# Altium schematic sheet X99_20241008.SchDoc
size A4
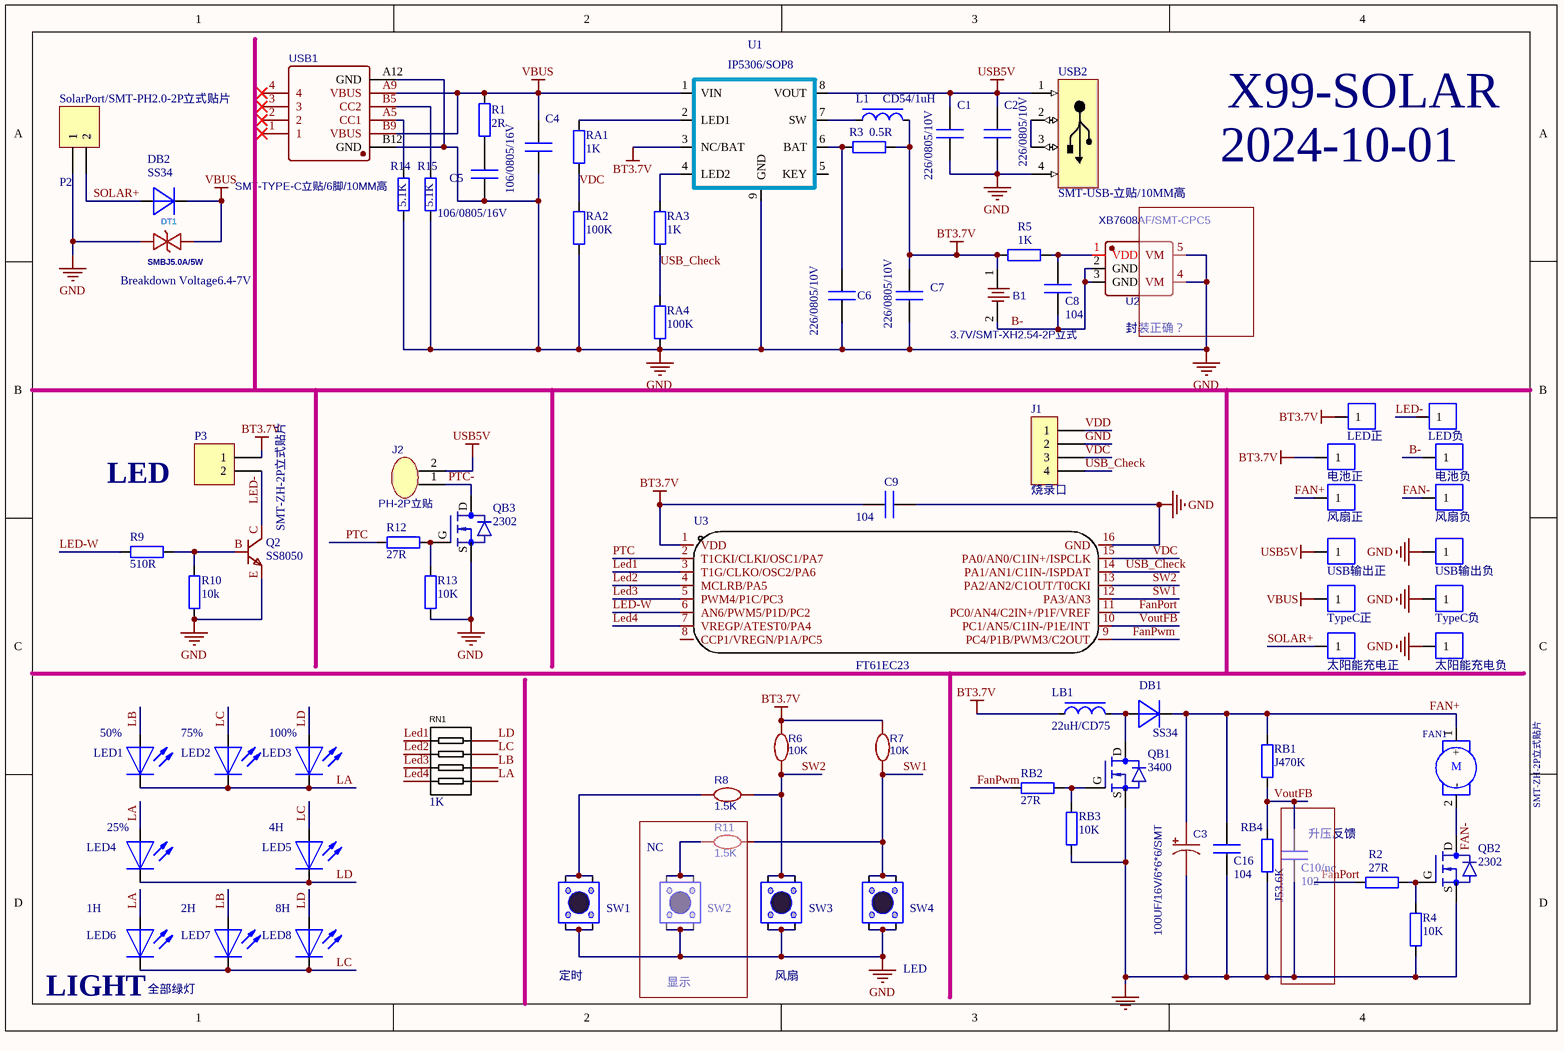
[diagram p0: X99_20241008.SchDoc]

## Parts
B1  3.7V/SMT-XH2.54-2P立式  [SMT-XH2.54-2P立式]
C1  226/0805/10V  [SMT-0805C]
C2  226/0805/10V  [SMT-0805C]
C3  100UF/16V/6*6*6/SMT  [CS 6*6 - V]
C4  106/0805/16V  [SMT-0805C]
C5  106/0805/16V  [SMT-0805C]
C6  226/0805/10V  [SMT-0805C]
C7  226/0805/10V  [SMT-0805C]
C8  104  [SMT-0603C]
C9  104  [SMT-0603C]
C10/nc  102  [SMT-0603C]
C16  104  [SMT-0603C]
DB1  SS34  [SMT-SMA(DO-214AC)]
DB2  SS34  [SMT-SMA(DO-214AC)]
DT1  SMBJ5.0A/5W  [SMT-SMB(DO-214AA)]
FAN1  SMT-ZH-2P立式贴片  [SMT-ZH-2AB]
J1  烧录口  [SMT-烧录口]
J2  PH-2P立贴  [SMT-PH2.0-2P立式贴片]
L1  CD54/1uH  [CD54]
LB1  22uH/CD75  [SMT-CD75_L]
LED1  (no value)  [SMT-0603LED（绿灯）]
LED2  (no value)  [SMT-0603LED（绿灯）]
LED3  (no value)  [SMT-0603LED（绿灯）]
LED4  (no value)  [SMT-0603LED（绿灯）]
LED5  (no value)  [SMT-0603LED（绿灯）]
LED6  (no value)  [SMT-0603LED（绿灯）]
LED7  (no value)  [SMT-0603LED（绿灯）]
LED8  (no value)  [SMT-0603LED（绿灯）]
LED正  测试点  [test3.0_top]  (value not drawn)
LED负  测试点  [test3.0_top]  (value not drawn)
P2  SolarPort/SMT-PH2.0-2P立式贴片  [SMT-PH2.0-2P立式贴片]
P3  SMT-ZH-2P立式贴片  [SMT-ZH-2AB]
Q2  SS8050  [SMT-SOT-23(BJT)]
QB1  3400  [SMT-SOT-23 (NMOS)]
QB2  2302  [SMT-SOT-23 (NMOS)]
QB3  2302  [SMT-SOT-23 (NMOS)]
R1  2R  [SMT-0603R]
R2  27R  [SMT-0603R]
R3  0.5R  [SMT-0603R]
R4  10K  [SMT-0603R]
R5  1K  [SMT-0603R]
R6  10K  [SMT-0603R]
R7  10K  [SMT-0603R]
R8  1.5K  [SMT-0603R]
R9  510R  [SMT-0603R]
R10  10k  [SMT-0603R]
R11  1.5K  [SMT-0603R]
R12  27R  [SMT-0603R]
R13  10K  [SMT-0603R]
R14  5.1K  [0603_R]
R15  5.1K  [0603_R]
RA1  1K  [SMT-0603R]
RA2  100K  [SMT-0603R]
RA3  1K  [SMT-0603R]
RA4  100K  [SMT-0603R]
RB1  J470K  [SMT-0603R]
RB2  27R  [SMT-0603R]
RB3  10K  [SMT-0603R]
RB4  J53.6K  [SMT-0603R]
RN1  1K  [SMT0603*4]
SW1  SMT-6X6*7.5  [SMT-6X6轻触开关通用]  (value not drawn)
SW2  SMT-6X6*7.5  [SMT-6X6轻触开关通用]  (value not drawn)
SW3  SMT-6X6*7.5  [SMT-6X6轻触开关通用]  (value not drawn)
SW4  SMT-6X6*7.5  [SMT-6X6轻触开关通用]  (value not drawn)
TypeC正  测试点  [test3.0_top]  (value not drawn)
TypeC负  测试点  [test3.0_top]  (value not drawn)
U1  IP5306/SOP8  [SMT-ESOP-8 锡膏]
U2  XB7608AF/SMT-CPC5  [SMT-CPC5]
U3  FT61EC23  [SMT-SOP-16]
USB1  SMT-TYPE-C立贴/6脚/10MM高  [SMT-TypeC-6P立式贴片(新)]
USB2  SMT-USB-立贴/10MM高  [SMT-USB-立贴]
USB输出正  测试点  [test3.0_top]  (value not drawn)
USB输出负  测试点  [test3.0_top]  (value not drawn)
太阳能充电正  测试点  [test3.0_top]  (value not drawn)
太阳能充电负  测试点  [test3.0_top]  (value not drawn)
电池正  测试点  [test3.0_top]  (value not drawn)
电池负  测试点  [test3.0_top]  (value not drawn)
风扇正  测试点  [test3.0_top]  (value not drawn)
风扇负  测试点  [test3.0_top]  (value not drawn)

## Blocks framed on the sheet
升压反馈: C10/nc

## Nets
BT3.7V: B1.1 C7.2 C9.2 L1.2 LB1.1 LED正.1 P3.1 R3.1 R5.2 R6.1 R7.1 U1.3(NC/BAT) U3.1(VDD) 电池正.1
GND: C1.1 C2.1 C3.2 C4.1 C5.1 C6.2 C7.1 C9.1 C10/nc.1 C16.1 DT1.1 J1.2 P2.1 Q2.E QB1.S QB2.S QB3.S R4.1 R10.1 R13.1 R14.2 R15.2 RA2.1 RA4.1 RB3.1 RB4.1 SW1.1 SW1.3 SW2.1 SW2.3 SW3.1 SW3.3 SW4.1 SW4.3 TypeC负.1 U1.9(GND) U2.4(VM) U2.5(VM) U3.16(GND) USB1.A12(GND) USB1.B12(GND) USB2.4 USB输出负.1 太阳能充电负.1
USB5V: C1.2 C2.2 J2.2 U1.8(VOUT) USB2.1 USB输出正.1
VBUS: C4.2 DB2.2 DT1.2 R1.2 TypeC正.1 U1.1(VIN) USB1.A9(VBUS) USB1.B9(VBUS)
B-: B1.2 C8.1 U2.2(GND) U2.3(GND) 电池负.1
FAN+: C3.1 C16.2 DB1.2 FAN1.1(+) RB1.2 风扇正.1
FAN-: FAN1.2(-) QB2.D 风扇负.1
FanPort: R2.2 U3.11(PC0/AN4/C2IN+/P1F/VREF)
FanPwm: RB2.1 U3.9(PC4/P1B/PWM3/C2OUT)
LA: LED1.2 LED2.2 LED3.2 LED4.1 LED6.1 RN1.5
LB: LED1.1 LED7.1 RN1.6
LC: LED2.1 LED5.1 LED6.2 LED7.2 LED8.2 RN1.7
LD: LED3.1 LED4.2 LED5.2 LED8.1 RN1.8
Led1: RN1.1 U3.3(T1G/CLKO/OSC2/PA6)
Led2: RN1.2 U3.4(MCLRB/PA5)
Led3: RN1.3 U3.5(PWM4/P1C/PC3)
Led4: RN1.4 U3.7(VREGP/ATEST0/PA4)
LED-: LED负.1 P3.2 Q2.C
LED-W: R9.1 U3.6(AN6/PWM5/P1D/PC2)
PTC: R12.2 U3.2(T1CKI/CLKI/OSC1/PA7)
PTC-: J2.1 QB3.D
SOLAR+: DB2.1 P2.2 太阳能充电正.1
SW1: R7.2 R11.2 SW4.2 SW4.4 U3.12(PA3/AN3)
SW2: R6.2 R8.2 SW3.2 SW3.4 U3.13(PA2/AN2/C1OUT/T0CKI)
USB_Check: J1.4 RA3.1 RA4.2 U3.14(PA1/AN1/C1IN-/ISPDAT)
VDC: J1.3 RA1.1 RA2.2 U3.15(PA0/AN0/C1IN+/ISPCLK)
VDD: J1.1
VoutFB: C10/nc.2 RB1.1 RB4.2 U3.10(PC1/AN5/C1IN-/P1E/INT)
NetC5_2: C5.2 R1.1
NetC6_1: C6.1 R3.2 U1.6(BAT)
NetC8_2: C8.2 R5.1 U2.1(VDD)
NetDB1_1: DB1.1 LB1.2 QB1.D
NetL1_1: L1.1 U1.7(SW)
NetQ2_B: Q2.B R9.2 R10.2
NetQB1_G: QB1.G RB2.2 RB3.2
NetQB2_G: QB2.G R2.1 R4.2
NetQB3_G: QB3.G R12.1 R13.2
NetR8_1: R8.1 SW1.2 SW1.4
NetR11_1: R11.1 SW2.2 SW2.4
NetR14_1: R14.1 USB1.A5(CC1)
NetR15_1: R15.1 USB1.B5(CC2)
NetRA1_2: RA1.2 U1.2(LED1)
NetRA3_2: RA3.2 U1.4(LED2)
NetUSB2_2: USB2.2 USB2.3

Not connected (* = marked no-connect by the designer): U1 5(KEY); U3 8(CCP1/VREGN/P1A/PC5); USB1 1* 2* 3* 4*

## Notes on the sheet
- X99-SOLAR
- 2024-10-01
- (near DT1) Breakdown Voltage6.4-7V
- (near U2) 封装正确？
- LED
- (near LED1) 50%
- 75%
- (near LED3) 100%
- (near LED4) 25%
- (near LED5) 4H
- (near SW2) NC
- 1H
- 2H
- 8H
- (near SW1) 定时
- 显示
- (near SW3) 风扇
- (near SW4) LED
- (near LED6) LIGHT
- (near LED6) 全部绿灯
- (in symbol MotorDC-P) M

## Library data of the parts
B1 = 12V: BOM_Manufacturer: Q&J; BOM_Manufacturer Part: CR1220-2; BOM_Supplier: LCSC; image: //image.lceda.cn/szlcsc/C70381.jpg; BOM_Supplier Part: C70381; spicePre: B; spiceSymbolName: CR1220-2
C1 C2 C4-C9 C10/nc C16 = Cap
C3 = 220uF/35V: BOM_Manufacturer: BERYL Electronic Tech; BOM_Manufacturer Part: RC050M4R7LO5*11TH-2A1E; nameAlias: Capacitance; Contributor: s-dawn; BOM_Supplier: LCSC; BOM_Supplier Part: C365767; BOM_JLCPCB Part Class: Extended Part; spicePre: C; spiceSymbolName: C1
DB1 DB2 = Diode
DT1 = SMBJ5.0CA_C19077559: Manufacturer: 宏迦橙; Add into BOM: yes; polarity: 双向; Reverse Stand-Off Voltage (Vrwm): 5V; Maximum Clamping Voltage: 9.2V; Peak Pulse Current (Ipp)@10/1000us: 65.22A; Peak Pulse Power Dissipation (Ppp)@10/1000us: 600W; Breakdown Voltage: 7V; Reverse Leakage Current (Ir): 800uA; Symbol: SMBJ5.0CA_C19077559; Device: SMBJ5.0CA_C19077559; LCSC Part Name: SMBJ5.0CA; Supplier Part: C19077559; Manufacturer Part: SMBJ5.0CA; Supplier Footprint: SMB; JLCPCB Part Class: Extended Part; Datasheet: https://atta.szlcsc.com/upload/public/pdf/source/20231129/482485C5E60BCB53F84D553F3B29D8A3.pdf; Supplier: LCSC; Convert to PCB: yes; Operating Temperature: -55℃~+155℃; Type: TVS
FAN1 = MotorDC-P
J1 = Pin HDR1X4
J2 = 2P: Contributor: guilingSong; spicePre: J; spiceSymbolName: 2P
L1 LB1 = L Core
LED1-LED8 = LED
LED正 LED负 TypeC正 TypeC负 USB输出正 USB输出负 太阳能充电正 太阳能充电负 电池正 电池负 风扇正 风扇负 = 1P
P2 P3 = Header 2: Header, 2-Pin; LatestRevisionDate: 17-Jul-2002; LatestRevisionNote: Re-released for DXP Platform.; Publisher: Altium Limited
Q2 = NPN
QB1-QB3 = N MOS
R1-R5 R9 R10 R12-R15 RA1-RA4 RB1-RB4 = Res
R6-R8 R11 = 1k: Contributor: LCEDA_Lib; spicePre: R; spiceSymbolName: R_0603_EU
RN1 = YC164-JR-070RL: Add into BOM: yes; Power(Watts): 62.5mW; Number of Resistors: 4; Symbol: YC164-JR-070RL; Device: YC164-JR-070RL; Supplier Part: C327053; Manufacturer Part: YC164-JR-070RL; Supplier Footprint: 0603x4; JLCPCB Part Class: Extended Part; Datasheet: https://atta.szlcsc.com/upload/public/pdf/source/20181031/C327053_83904E7E99C831138D2428A732EF3A25.pdf; Supplier: LCSC; Convert to PCB: yes; Number of Pins: 8
SW1-SW4 = SW-4
U1 = IC-IP5303
U2 = XB7608AF: Contributor: LCSC; BOM_Supplier: LCSC; BOM_Supplier Part: C249345; BOM_Manufacturer Part: XB7608AF; spicePre: U; spiceSymbolName: XB7608AF
U3 = FT61FC23-RB: Add into BOM: yes; Name: FT61FC23-RB; Symbol: FT61FC23-RB; Device: FT61FC23-RB; LCSC Part Name: FT61FC23-RB; Supplier Part: C2984838; Manufacturer Part: FT61FC23-RB; Supplier Footprint: SOP-16; Datasheet: https://atta.szlcsc.com/upload/public/pdf/source/20220412/81CC0B2D560F8A4F64BD4CAEFEE1BFE1.pdf; Supplier: LCSC; Convert to PCB: yes
USB1 = TYPE-C-31-M-16: BOM_Manufacturer: Korean Hroparts Elec; Contributor: LCSC; BOM_Supplier: LCSC; BOM_Supplier Part: C283541; BOM_Manufacturer Part: TYPE-C-31-M-16; BOM_JLCPCB Part Class: Extended Part; spicePre: U; spiceSymbolName: TYPE-C-31-M-16
USB2 = USB